# Altium schematic sheet lpGBT-VTRX.SchDoc: LpGBT
size A; DrawnBy: anp sxw; Organization: Boston University EDF; DocumentNumber: 6; SheetNumber: 7; SheetTotal: 21
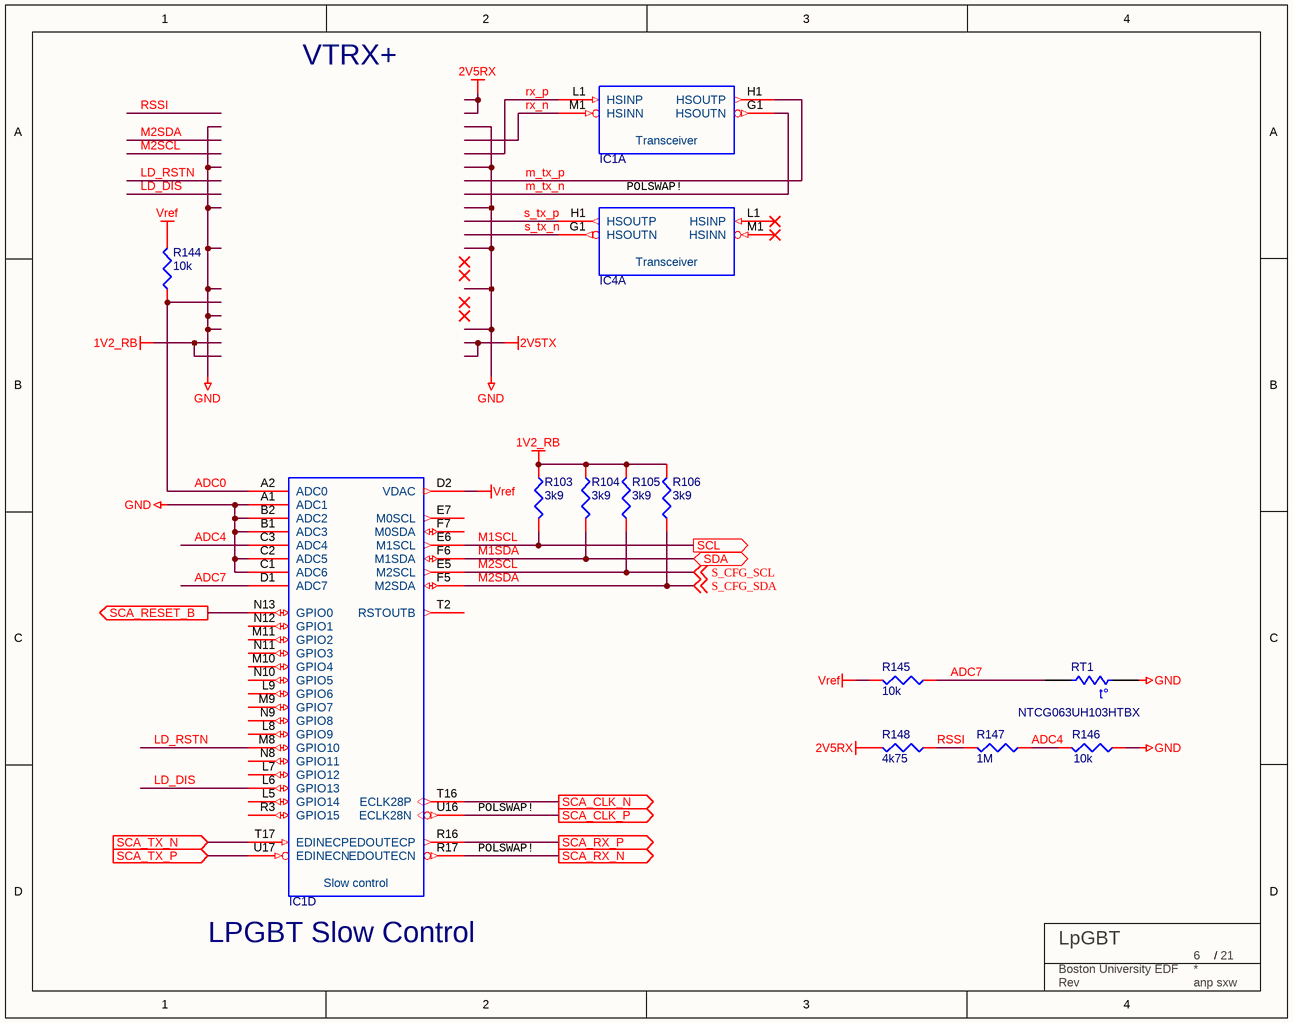
[diagram p0: lpGBT-VTRX.SchDoc]

## Parts
IC1  LPGBT  [BGA289X17]  (value not drawn)  (parts A,D of 8)
IC4  LPGBT  [BGA289X17]  (value not drawn)  (part A of 8)
R103  3k9  [R_0402_IPC]
R104  3k9  [R_0402_IPC]
R105  3k9  [R_0402_IPC]
R106  3k9  [R_0402_IPC]
R144  10k  [R_0402_IPC]
R145  10k  [R_0402_IPC]
R146  10k  [R_0402_IPC]
R147  1M  [R_0402_IPC]
R148  4k75  [R_0402_IPC]
RT1  NTCG063UH103HTBX  [resc0603]
TBLOCK?  BU Title block  (value not drawn)  (graphical)

## Ports
SCA_CLK_N (out), SCA_CLK_P (out), SCA_RESET_B (out), SCA_RX_N (out), SCA_RX_P (out), SCA_TX_N (in), SCA_TX_P (in), SCL (out), SDA (bidir)

## Nets
1V2_RB: R103.1 R104.1 R105.2 R106.2
2V5RX: R148.2
GND: IC1.A1(ADC1) IC1.B1(ADC3) IC1.B2(ADC2) IC1.C1(ADC6) IC1.C2(ADC5) R146.1 RT1.1
Vref: IC1.D2(VDAC) R144.2 R145.2
ADC0: IC1.A2(ADC0) R144.1
ADC4: IC1.C3(ADC4) R146.2 R147.1
ADC7: IC1.D1(ADC7) R145.1 RT1.2
LD_DIS: IC1.L6(GPIO13)
LD_RSTN: IC1.M8(GPIO10)
M1SCL: IC1.E6(M1SCL) R103.2 ; port SCL
M1SDA: IC1.F6(M1SDA) R104.2 ; port SDA
M2SCL: IC1.E5(M2SCL) R105.1 ; off-sheet S_CFG_SCL  [also labelled S_CFG_SCL]
M2SDA: IC1.F5(M2SDA) R106.1 ; off-sheet S_CFG_SDA  [also labelled S_CFG_SDA]
m_tx_n: IC1.G1(HSOUTN)
m_tx_p: IC1.H1(HSOUTP)
RSSI: R147.2 R148.1
rx_n: IC1.M1(HSINN)
rx_p: IC1.L1(HSINP)
s_tx_n: IC4.G1(HSOUTN)
s_tx_p: IC4.H1(HSOUTP)
SCA_CLK_N: IC1.T16(ECLK28P) ; port SCA_CLK_N
SCA_CLK_P: IC1.U16(ECLK28N) ; port SCA_CLK_P
SCA_RESET_B: IC1.N13(GPIO0) ; port SCA_RESET_B
SCA_RX_N: IC1.R17(EDOUTECN) ; port SCA_RX_N
SCA_RX_P: IC1.R16(EDOUTECP) ; port SCA_RX_P
SCA_TX_N: IC1.T17(EDINECP) ; port SCA_TX_N
SCA_TX_P: IC1.U17(EDINECN) ; port SCA_TX_P

Not connected (* = marked no-connect by the designer): IC1 E7(M0SCL) F7(M0SDA) L5(GPIO14) L7(GPIO12) L8(GPIO9) L9(GPIO6) M9(GPIO7) M10(GPIO4) M11(GPIO2) N8(GPIO11) N9(GPIO8) N10(GPIO5) N11(GPIO3) N12(GPIO1) R3(GPIO15) T2(RSTOUTB); IC4 L1(HSINP)* M1(HSINN)*

## Notes on the sheet
- VTRX+
- (near IC4) POLSWAP!
- POLSWAP!
- LPGBT Slow Control
- (in symbol LPGBT, part A) Transceiver
- (in symbol LPGBT, part D) Slow control
- (in symbol Res Thermal) t°
- (in symbol TITLE_BLOCK_BU) /; Rev

## Library data of the parts
IC1 IC4 = LPGBT: Low Power Gigabit Transceiver; Manufacturer: CERN; Pinout Version: 180226; Bonding: No; Device: LPGBT; Manufacturer Part Number: LPGBT; SMD: Yes; Mounted: Yes; LatestRevisionDate: 26.10.2018; PackageDescription: BGA, 289-Leads, Body 9.00x9.00mmx1.28mm, Pitch 0.50mm; Part Description: Low Power Gigabit Transceiver; Case: BGA289; Part Number: LPGBT; Pin Count: 289; Socket: No; Component Kind: Standard; Component Type: Standard; Footprint: BGA289C50P17X17_900X900X128
R103-R106 = R-E3-3K9-0402-5%: RES SMD 3.9K OHM 5% 1/16W 0402
R144 R145 = R-E4-10k-0402-0.5%: RES SMD 1.2K OHM 0.5% 1/16W 0402; Part Number: RR0510P-103-D
R146 = R-E5-402k0-0402-1%: RES SMD 402K OHM 1% 1/16W 0402; Part Number: RR0510P-103-D
R147 = R-E6-1M0-0402-1%: RES SMD 1M OHM 1% 1/16W 0402; Part Number: ERJ-2RKF4751X0402
R148 = R-E3-4K75-0402-1%: RES SMD 4.75K OHM 1% 1/10W 0402; Part Number: ERJ-2RKF4751X0402
RT1 = Res Thermal: Thermistor; Published: 24-Mar-1999; LatestRevisionDate: 29-May-2009; LatestRevisionNote: IPC-7351 Footprint Added.; PackageVersion: Mar-2003; PackageReference: 6-0805; Publisher: Altium Limited; PackageDescription: Chip Resistor 0805 Case Size; Code_IPC: RESC2012
TBLOCK? = TITLE_BLOCK_BU